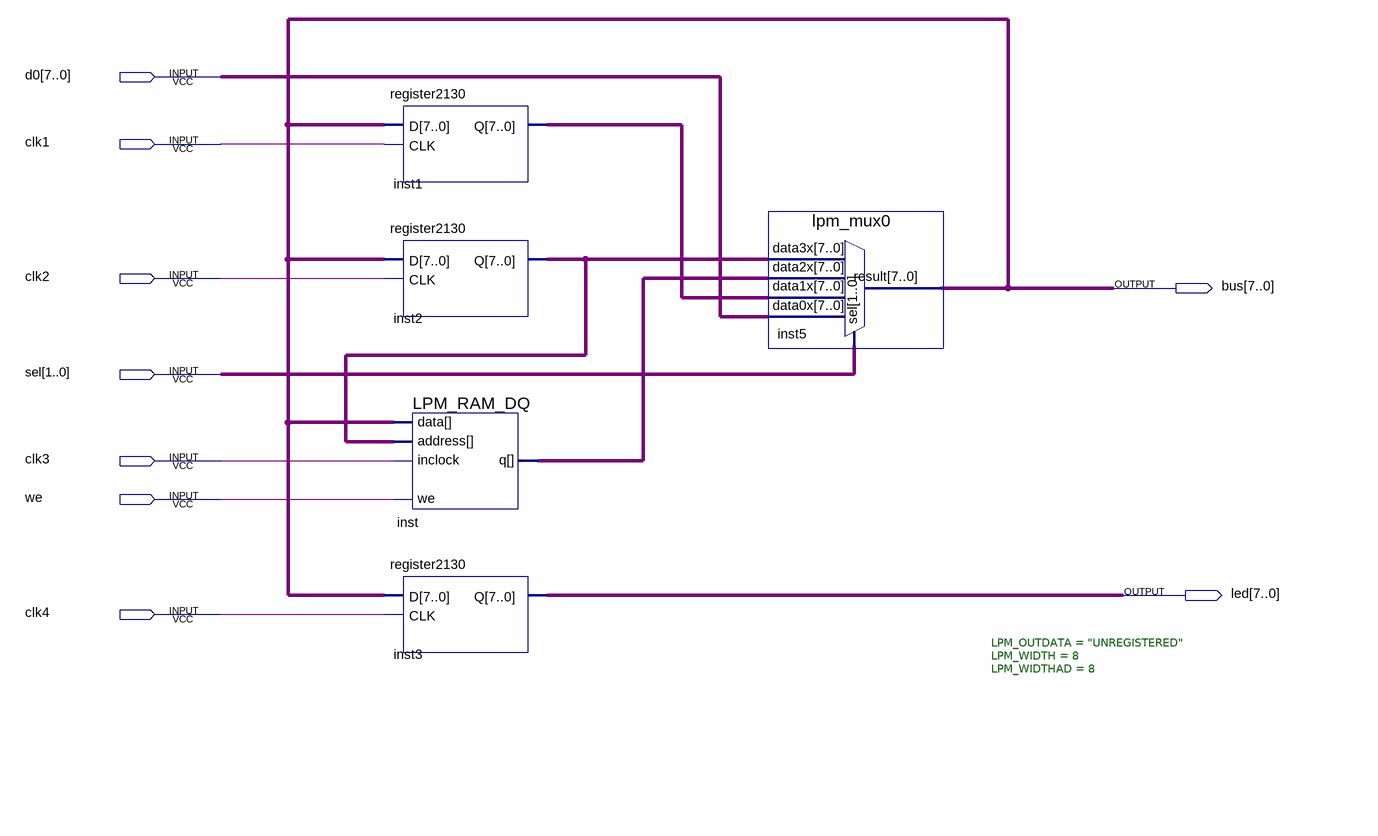
[diagram p0: schematic sheet]
// Quartus schematic BUS2130.bdf as structural Verilog: 5 symbols, 9 pins
module BUS2130 (
  input  [7:0] d0,
  input  clk1,
  input  clk2,
  input  [1:0] sel,
  input  clk3,
  input  we,
  input  clk4,
  output [7:0] bus,
  output [7:0] led
);

  wire [7:0] inst1_q, inst2_q, inst_q;

  register2130 inst1 (.D(bus), .CLK(clk1), .Q(inst1_q));
  register2130 inst2 (.D(bus), .CLK(clk2), .Q(inst2_q));
  LPM_RAM_DQ #(.LPM_OUTDATA("UNREGISTERED"), .LPM_WIDTH(8), .LPM_WIDTHAD(8)) inst (
    .address(inst2_q), .data(bus), .inclock(clk3), .we(we), .q(inst_q));
  register2130 inst3 (.D(bus), .CLK(clk4), .Q(led));
  lpm_mux0 inst5 (.data3x(inst2_q), .data2x(inst_q), .data1x(inst1_q), .data0x(d0), .sel(sel), .result(bus));
endmodule
